# Altium schematic sheet place_plan.SchDoc
size A4
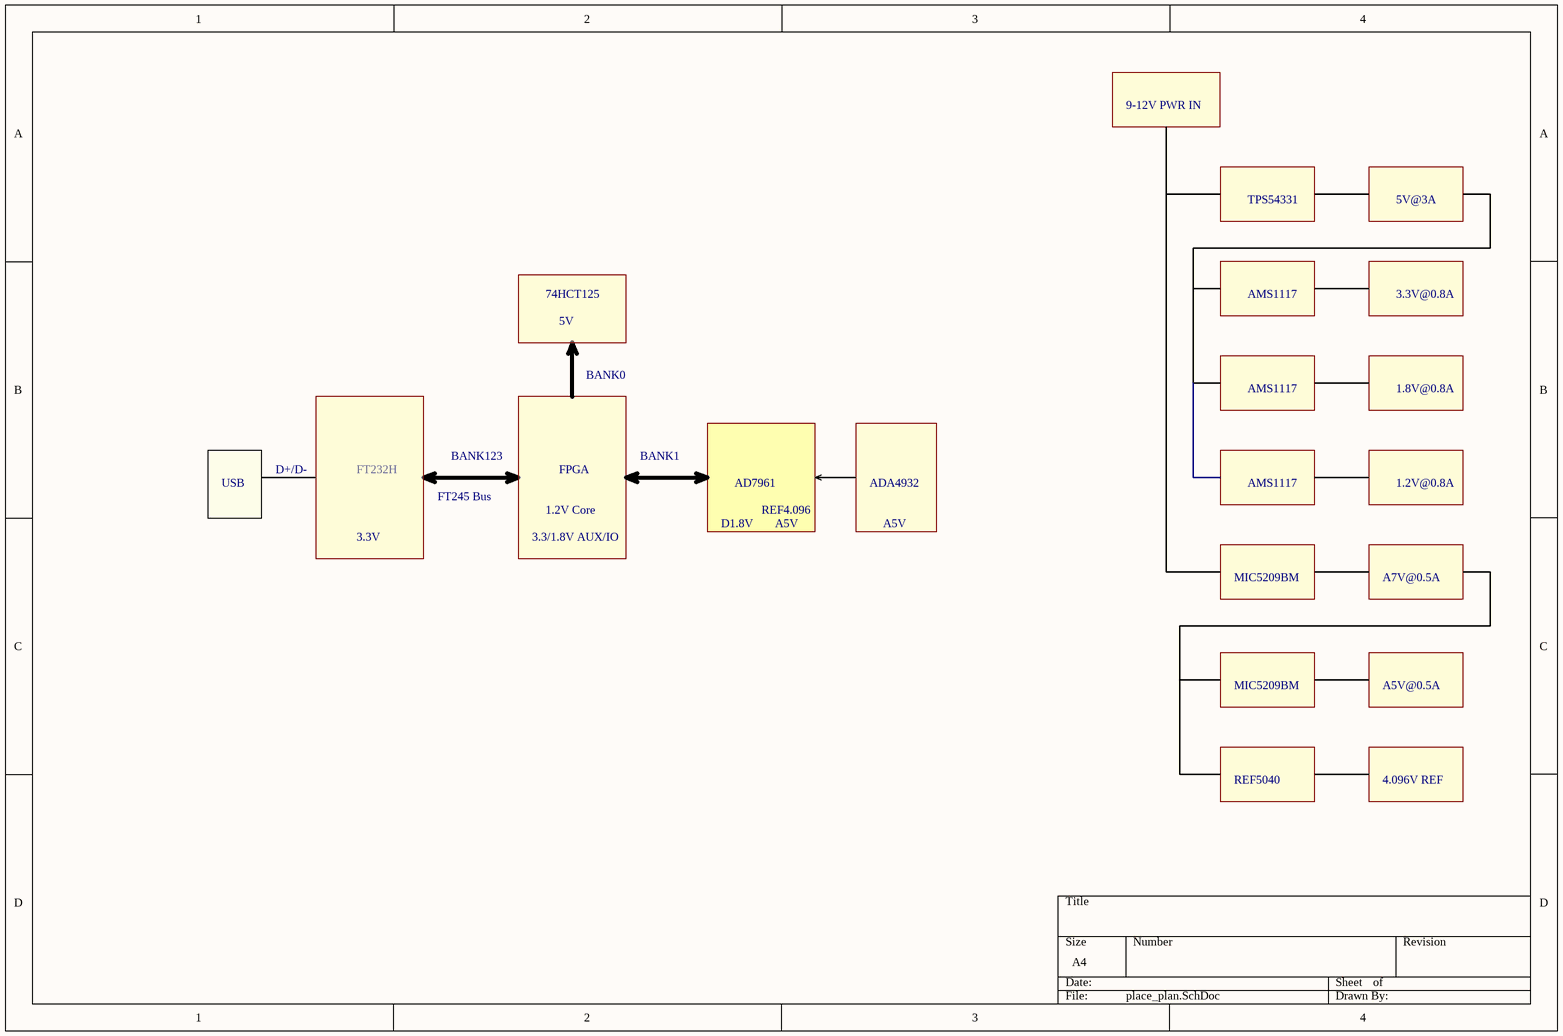
[diagram p0: place_plan.SchDoc]

## Notes on the sheet
- 9-12V PWR IN
- TPS54331
- 5V@3A
- 74HCT125
- AMS1117
- 3.3V@0.8A
- 5V
- BANK0
- 1.8V@0.8A
- USB
- D+/D-
- FT232H
- FT245 Bus
- BANK123
- 1.2V Core
- FPGA
- BANK1
- AD7961
- REF4.096
- ADA4932
- 1.2V@0.8A
- 3.3V
- 3.3/1.8V AUX/IO
- D1.8V
- A5V
- MIC5209BM
- A7V@0.5A
- A5V@0.5A
- REF5040
- 4.096V REF